# EAGLE design pufferswitch (EAGLE 9.6.2)
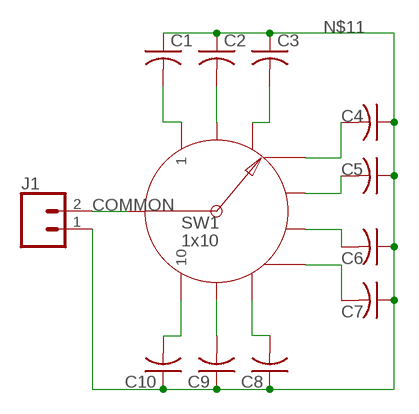
[diagram p0: schematic, sheet 1]

## Parts
C1  C-US025-024X044  [C025-024X044]
C2  C-US025-024X044  [C025-024X044]
C3  C-US025-024X044  [C025-024X044]
C4  C-US025-024X044  [C025-024X044]
C5  C-US025-024X044  [C025-024X044]
C6  C-US025-024X044  [C025-024X044]
C7  C-US025-024X044  [C025-024X044]
C8  C-US025-024X044  [C025-024X044]
C9  C-US025-024X044  [C025-024X044]
C10  C-US025-024X044  [C025-024X044]
J1  CONN_02  [1X02]
SW1  1x10  SWITCH_ROTARY_1X10KIT  [ROTARY_SWITCH_1X10_KIT]

## Nets
COMMON: J1.2 SW1.COMMON
N$1: C1.2 SW1.1
N$2: C2.2 SW1.2
N$3: C3.2 SW1.3
N$4: C4.2 SW1.4
N$5: C5.2 SW1.5
N$6: C6.2 SW1.6
N$7: C7.2 SW1.7
N$8: C8.2 SW1.8
N$9: C9.2 SW1.9
N$10: C10.2 SW1.10
N$11: C1.1 C2.1 C3.1 C4.1 C5.1 C6.1 C7.1 C8.1 C9.1 C10.1 J1.1

## Library data of the parts
C1-C10 = rcl:C-US: CAPACITOR, American symbol; SPICEPREFIX: C
J1 = SparkFun-Connectors:CONN_02: Multi connection point. Often used as Generic Header-pin footprint for 0.1 inch spaced/style header connections On any of the 0.1 inch spaced packages, you can populate with these: Break Away Headers - Straight <https://www.sparkfun.com/products/116> (PRT-00116) Break Away Male Headers - Right Angle <https://www.sparkfun.com/products/553> (PRT-00553) Female Headers <https://www.sparkfun.com/products/115> (PRT-00115) Break Away Headers - Machine Pin <https://www.sparkfun.com/products/117> (PRT-00117) Break Away Female Headers - Swiss Machine Pin <https://www.sparkfun.com/products/743> (PRT-00743) For SCREWTERMINALS and SPRING TERMINALS visit here: Screw Terimnals on SparkFun.com <https://www.sparkfun.com/search/results?term=Screw+Terminals> (5mm/3.5mm/2.54mm spacing) This device is also useful as a general connection point to wire up your design to another part of your project. Our various solder wires solder well into these plated through hole pads. Hook-Up Wire - Assortment (Stranded, 22 AWG) <https://www.sparkfun.com/products/11375> (PRT-11375) Hook-Up Wire - Assortment (Solid Core, 22 AWG) <https://www.sparkfun.com/products/11367> (PRT-11367) View the entire wire category on our website here <https://www.sparkfun.com/categories/141> Special notes: Molex polarized connector foot print use with: PRT-08233 with associated crimp pins and housings. 2.54_SCREWTERM for use with PRT-10571. 3.5mm Screw Terminal footprints for PRT-08084 5mm Screw Terminal footprints for use with PRT-08432
SW1 = SparkFun-Electromechanical:SWITCH_ROTARY_1X10: SWCH-12120; PROD_ID: SWCH-12120

## Board
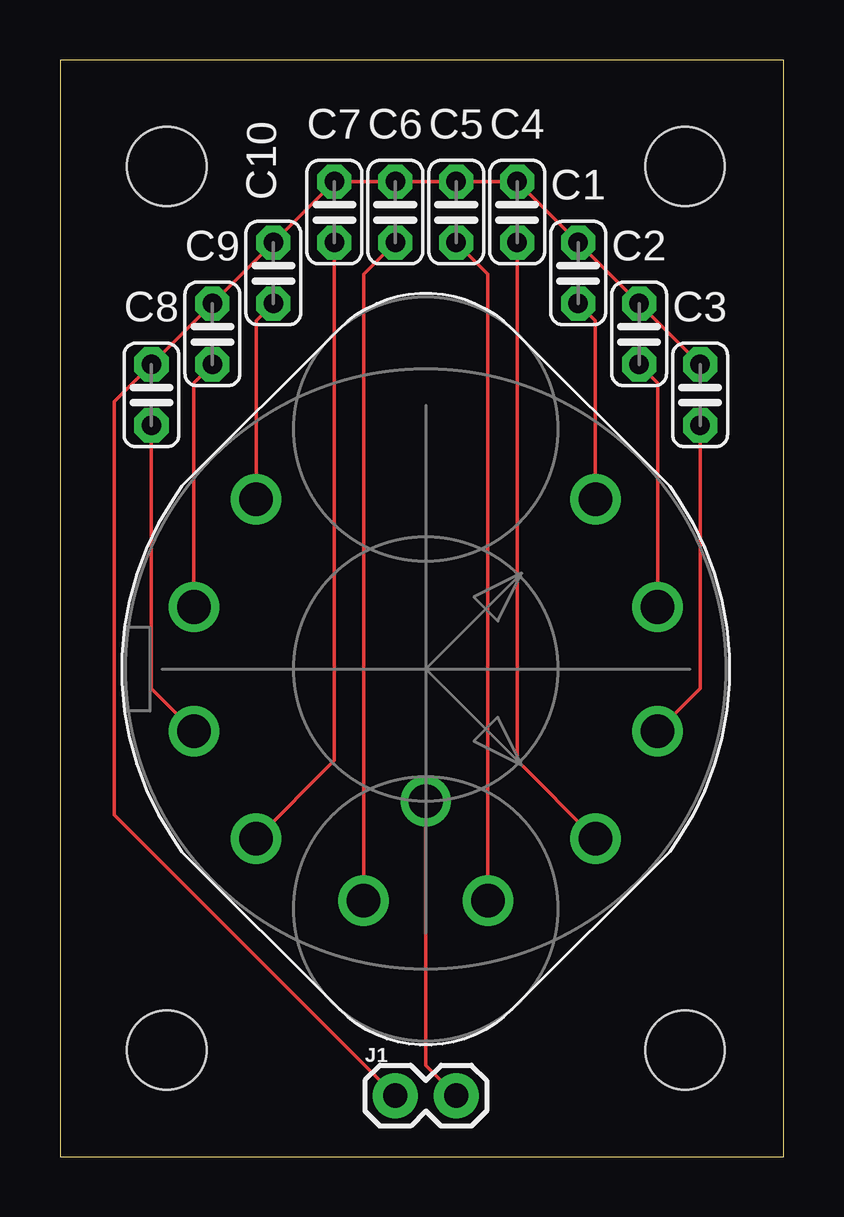
[diagram p1: board, top side]

Size 30.15 x 45.71 mm. Coordinates in mm from the lower left corner, seen from the top.
Outline: 0,0 30.15,0 30.15,45.71 0,45.71 0,0
Copper layers (1*16): Top 0.035mm / dielectric 1.5mm / Bottom 0.035mm
Design rules "default *": minimum track width 7mil, minimum drill 15mil, track to track 8mil, track to pad 8mil, pad to pad 8mil, via to via 8mil, smd to smd 8mil, copper to edge 8mil, drill to drill 8mil, minimum pad ring 12mil, minimum via ring 10mil, stop-mask expansion 4mil, vias tented up to drill 20mil, thermal gap 10mil

### Footprints (pad centres in the part's own frame; a part is rotated, then mirrored left to right if it is on the bottom)
C025-024X044 = drill 0.813 octagon: 1 -1.27,0; 2 1.27,0
1X02 = drill 1.016 pad 1.88: 1 0,0; 2 2.54,0
STAND-OFF = hole 3.302: 0,0
ROTARY_SWITCH_1X10_KIT = drill 1.4: 1 7.071,7.071; 2 9.659,2.588; 3 9.659,-2.588; 4 7.071,-7.071; 5 2.588,-9.659; 6 -2.588,-9.659; 7 -7.071,-7.071; 8 -9.659,-2.588; 9 -9.659,2.588; 10 -7.071,7.071; COMMON 0,-5.5

### Placement (x,y rotation side)
C1  21.59,36.83 270 top
C2  24.13,34.29 270 top
C3  26.67,31.75 270 top
C4  19.05,39.37 270 top
C5  16.51,39.37 270 top
C6  13.97,39.37 270 top
C7  11.43,39.37 270 top
C8  3.81,31.75 270 top
C9  6.35,34.29 270 top
C10  8.89,36.83 270 top
J1  13.97,2.54 0 top
STANDOFF1  STAND-OFF  [STAND-OFF]  4.45,4.45 0 top
STANDOFF2  STAND-OFF  [STAND-OFF]  26.04,4.45 0 top
STANDOFF3  STAND-OFF  [STAND-OFF]  4.45,41.27 0 top
STANDOFF4  STAND-OFF  [STAND-OFF]  26.04,41.27 0 top
SW1  15.24,20.32 0 top

### Tracks (layer width: path | path; a pad name or v marks a point on that pad's centre or on a via)
COMMON
  Top 0.152: J1.2 15.24,3.81 SW1.COMMON
N$1
  Top 0.152: C1.2 22.31,34.84 SW1.1
N$2
  Top 0.152: SW1.2 24.9,32.25 C2.2
N$3
  Top 0.152: SW1.3 26.67,19.5 C3.2
N$4
  Top 0.152: SW1.4 19.05,16.51 C4.2
N$5
  Top 0.152: SW1.5 17.83,36.78 C5.2
N$6
  Top 0.152: SW1.6 12.65,36.78 C6.2
N$7
  Top 0.152: SW1.7 11.43,16.51 C7.2
N$8
  Top 0.152: SW1.8 3.81,19.5 C8.2
N$9
  Top 0.152: SW1.9 5.58,32.25 C9.2
N$10
  Top 0.152: C10.2 8.17,34.84 SW1.10
N$11
  Top 0.152: C3.1 C2.1 C1.1 C4.1 C5.1 C6.1 C7.1 C10.1 C9.1 C8.1 2.26,31.47 2.26,14.25 J1.1